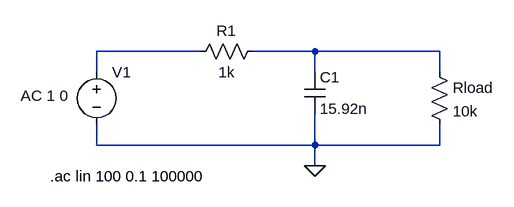
[diagram p0: schematic c01ex40s01.asc]
c01ex40s01.asc, the LTspice schematic file:
Version 4
SHEET 1 880 680
WIRE 224 32 64 32
WIRE 400 32 304 32
WIRE 592 32 400 32
WIRE 64 64 64 32
WIRE 400 64 400 32
WIRE 592 64 592 32
WIRE 64 176 64 144
WIRE 400 176 400 128
WIRE 400 176 64 176
WIRE 592 176 592 144
WIRE 592 176 400 176
WIRE 400 208 400 176
FLAG 400 208 0
SYMBOL voltage 64 48 R0
WINDOW 123 -117 52 Left 2
WINDOW 39 0 0 Left 0
SYMATTR Value2 AC 1 0
SYMATTR InstName V1
SYMATTR Value ""
SYMBOL res 576 48 R0
SYMATTR InstName Rload
SYMATTR Value 10k
SYMBOL cap 384 64 R0
SYMATTR InstName C1
SYMATTR Value 15.92n
SYMBOL res 320 16 R90
WINDOW 0 0 56 VBottom 2
WINDOW 3 32 56 VTop 2
SYMATTR InstName R1
SYMATTR Value 1k
TEXT -8 224 Left 2 !.ac lin 100 0.1 100000

The netlist it stands for:
* c01ex40s01.asc
V1 N001 0 AC 1 0
Rload N002 0 10k
C1 N002 0 15.92n
R1 N002 N001 1k
.ac lin 100 0.1 100000
.backanno
.end